# EAGLE design dashbutton_2450_v4 (EAGLE 9.1.3)
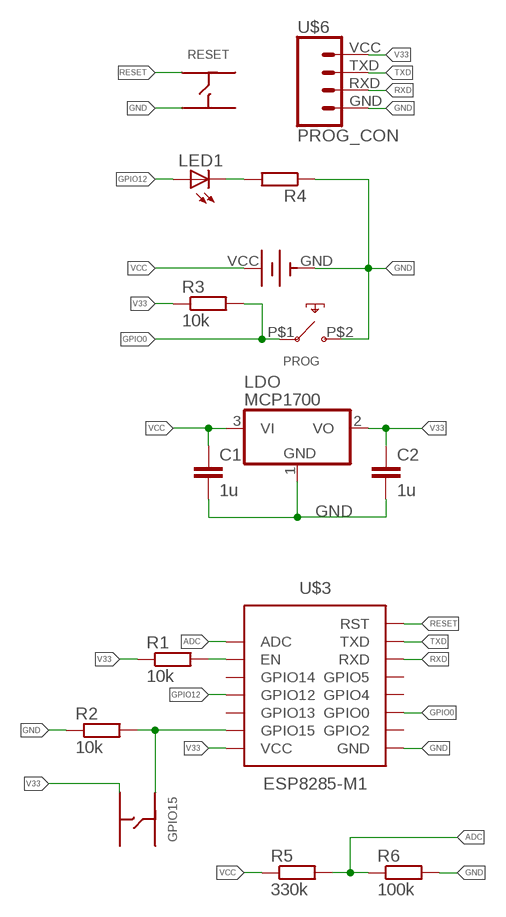
[diagram p0: schematic, sheet 1]

## Parts
C1  1u  C-EUC1206  [C1206]
C2  1u  C-EUC1206  [C1206]
GPIO15  6X6BUTTON  [6X6BUTTON]
LDO  MCP1700  MCP1703CB  [SOT23]
LED1  LEDCHIPLED_1206  [CHIPLED_1206]
PROG  3X4_SMD_BUTTON  [3X4BUTTON]
R1  10k  R-EU_R0603  [R0603]
R2  10k  R-EU_R0603  [R0603]
R3  10k  R-EU_R0603  [R0603]
R4  R-EU_R1206  [R1206]
R5  330k  R-EU_R0603  [R0603]
R6  100k  R-EU_R0603  [R0603]
RESET  6X6BUTTON  [6X6BUTTON]
U$2  2450_BATTERYHOLDER_SMD  [2450_BATTERYHOLDER_SMD]
U$3  ESP8285-M1  [ESP8285-M1]
U$6  PROG_CON  [PROG_CON]

## Nets
ADC: R5.2 R6.1 U$3.ADC
GND: C1.2 C2.2 LDO.1(GND) PROG.P$2(P2) R2.1 R4.1 R6.2 RESET.P1(A1) U$2.GND U$3.GND U$6.GND
GPIO0: PROG.P$1(P1) R3.2 U$3.GPIO0
GPIO12: LED1.A U$3.GPIO12
GPIO15: GPIO15.P4(U2) R2.2 U$3.GPIO15
N$3: LED1.C R4.2
N$5: R1.2 U$3.EN
RESET: RESET.P3(U1) U$3.RST
RXD: U$3.RXD U$6.RXD
TXD: U$3.TXD U$6.TXD
V33: C2.1 GPIO15.P2(A2) LDO.2(VO) R1.1 R3.1 U$3.V33(VCC) U$6.VCC
VCC: C1.1 LDO.3(VI) R5.1 U$2.VCC
Unconnected: GPIO15.P1(A1) GPIO15.P3(U1) RESET.P2(A2) RESET.P4(U2) U$3.GPIO2 U$3.GPIO4 U$3.GPIO5 U$3.GPIO13 U$3.GPIO14

## Library data of the parts
C1 C2 = rcl:C-EU: CAPACITOR, European symbol; SPICEPREFIX: C
GPIO15 RESET = moekoe:6X6BUTTON
LDO = linear:MCP1703: 250 mA, 16V, Low Quiescent Current LDO Regulator Source: http://ww1.microchip.com/downloads/en/DeviceDoc/22049b.pdf
LED1 = adafruit:LED: LED OSRAM: - CHIPLED LG R971, LG N971, LY N971, LG Q971, LY Q971, LO R971, LY R971 LH N974, LH R974 LS Q976, LO Q976, LY Q976 LO Q996 - Hyper CHIPLED LW Q18S LB Q993, LB Q99A, LB R99A - SideLED LS A670, LO A670, LY A670, LG A670, LP A670 LB A673, LV A673, LT A673, LW A673 LH A674 LY A675 LS A676, LA A676, LO A676, LY A676, LW A676 LS A679, LY A679, LG A679 - Hyper Micro SIDELED® LS Y876, LA Y876, LO Y876, LY Y876 LT Y87S - SmartLED LW L88C, LW L88S LB L89C, LB L89S, LG L890 LS L89K, LO L89K, LY L89K LS L896, LA L896, LO L896, LY L896 - TOPLED LS T670, LO T670, LY T670, LG T670, LP T670 LSG T670, LSP T670, LSY T670, LOP T670, LYG T670 LG T671, LOG T671, LSG T671 LB T673, LV T673, LT T673, LW T673 LH T674 LS T676, LA T676, LO T676, LY T676, LB T676, LH T676, LSB T676, LW T676 LB T67C, LV T67C, LT T67C, LS T67K, LO T67K, LY T67K, LW E67C LS E67B, LA E67B, LO E67B, LY E67B, LB E67C, LV E67C, LT E67C LW T67C LS T679, LY T679, LG T679 LS T770, LO T770, LY T770, LG T770, LP T770 LB T773, LV T773, LT T773, LW T773 LH T774 LS E675, LA E675, LY E675, LS T675 LS T776, LA T776, LO T776, LY T776, LB T776 LHGB T686 LT T68C, LB T68C - Hyper Mini TOPLED® LB M676 - Mini TOPLED Santana® LG M470 LS M47K, LO M47K, LY M47K Source: http://www.osram.convergy.de/
PROG = moekoe:3X4_SMD_BUTTON
R1-R6 = rcl:R-EU_: RESISTOR, European symbol; SPICEPREFIX: R
U$2 = moekoe:2450_BATTERYHOLDER_SMD
U$3 = moekoe:ESP8285-M1
U$6 = moekoe:PROG_CON

## Board
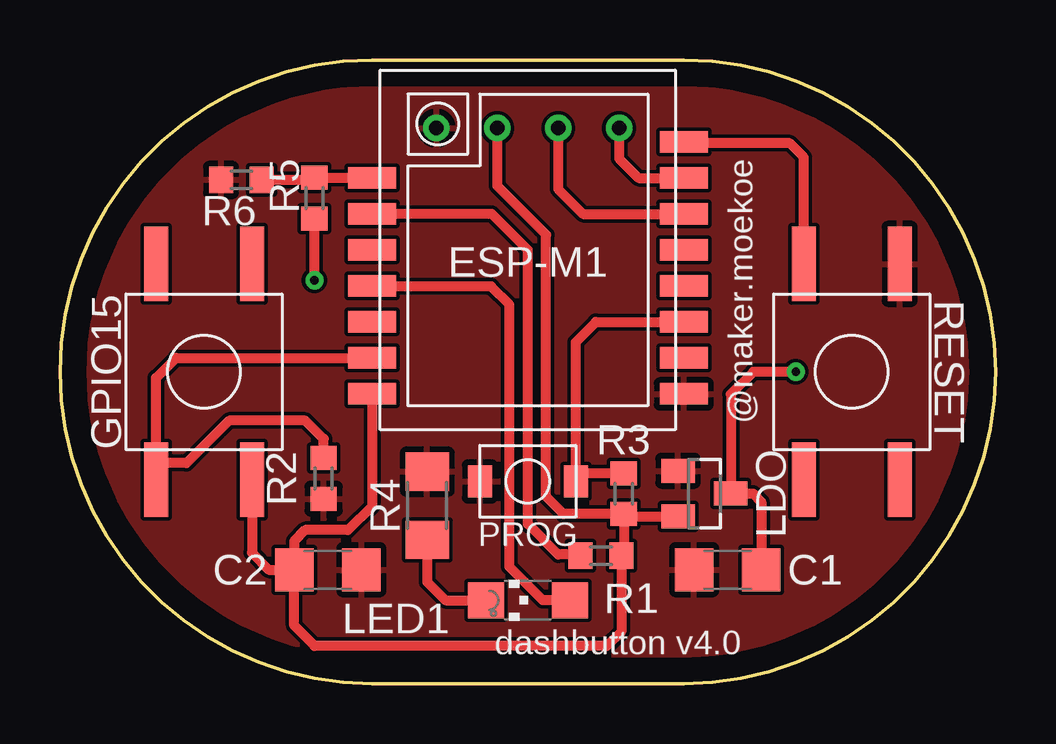
[diagram p1: board, top side]
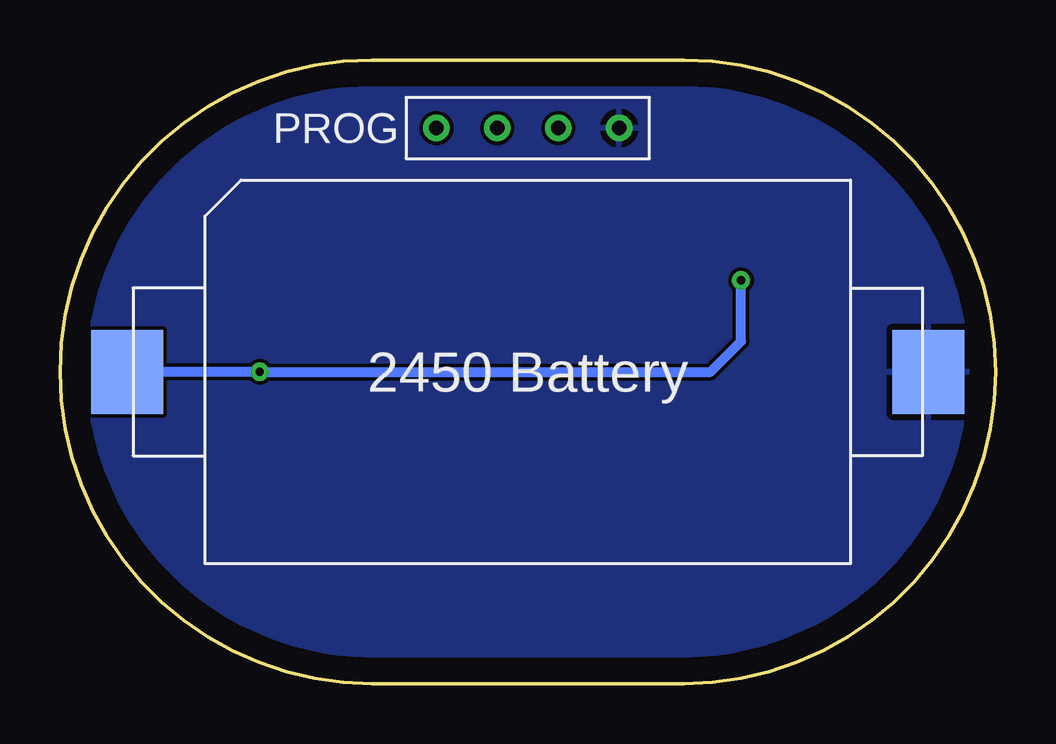
[diagram p2: board, bottom side, seen from below]

Size 39 x 26 mm. Coordinates in mm from the lower left corner, seen from the top.
Outline: 39,13 arc-90 26,0 13,0 arc-90 0,13 arc-90 13,26 26,26 arc-90 39,13
Copper layers (1*16): Top 0.035mm / dielectric 1.5mm / Bottom 0.035mm
Design rules "default": minimum track width 6mil, minimum drill 0.35mm, track to track 6mil, track to pad 6mil, pad to pad 6mil, via to via 6mil, smd to smd 6mil, copper to edge 40mil, drill to drill 6mil, minimum pad ring 10mil, minimum via ring 8mil, stop-mask expansion 4mil, vias tented up to drill 0mil, thermal gap 10mil

### Footprints (pad centres in the part's own frame; a part is rotated, then mirrored left to right if it is on the bottom)
C1206 = smd 1.6 x 1.8: 1 -1.4,0; 2 1.4,0
6X6BUTTON = smd 3.1 x 1: P1 -4.5,2; P2 4.5,2; P3 -4.5,-2; P4 4.5,-2
SOT23 = smd 1 x 1.4: 1 -0.95,-1.1; 2 0.95,-1.1; 3 0,1.1
CHIPLED_1206 = smd 1.5 x 1.5: A 0,-1.75; C 0,1.75
3X4BUTTON = smd 1 x 1.35: P$1 -2,0; P$2 2,0
R0603 = smd 1 x 1.1: 1 -0.85,0; 2 0.85,0
R1206 = smd 1.6 x 1.803: 1 -1.422,0; 2 1.422,0
2450_BATTERYHOLDER_SMD = smd 3 x 3.5: GND 16.7,0; VCC -16.7,0
ESP8285-M1 = smd 2 x 0.9: ADC -6.5,3; EN -6.5,1.5; GND 6.5,-6; GPIO0 6.5,-3; GPIO2 6.5,-4.5; GPIO4 6.5,-1.5; GPIO5 6.5,0; GPIO12 -6.5,-1.5; GPIO13 -6.5,-3; GPIO14 -6.5,0; GPIO15 -6.5,-4.5; RST 6.5,4.5; RXD 6.5,1.5; TXD 6.5,3; V33 -6.5,-6
PROG_CON = drill 0.6: GND 3.81,0; RXD -1.27,0; TXD -3.81,0; VCC 1.27,0

### Placement (x,y rotation side)
C1  27.84,4.74 180 top
C2  11.16,4.74 0 top
GPIO15  6,13 270 top
LDO  26.87,7.92 270 top
LED1  19.5,3.47 90 top
PROG  19.5,8.43 180 top
R1  22.55,5.33 180 top
R2  10.99,8.55 90 top
R3  23.5,7.92 90 top
R4  15.31,7.41 270 top
R5  10.61,20.24 90 top
R6  7.56,21 180 top
RESET  33,13 270 top
U$2  19.5,13 0 bottom
U$3  19.5,18.08 0 top
U$6  19.5,23.16 0 bottom

### Tracks (layer width: path | path; a pad name or v marks a point on that pad's centre or on a via)
ADC
  Top 0.406: R6.1 10.52,21 R5.2 U$3.ADC
GND
  pour Top: -0.82,26.97 39.82,26.97 39.82,-0.97 -0.82,-0.97
  pour Bottom: -0.82,26.97 39.82,26.97 39.82,-0.97 -0.82,-0.97
GPIO0
  Top 0.406: PROG.P$1 21.5,14.24 22.34,15.08 U$3.GPIO0 | 21.84,8.77 PROG.P$1 | R3.2 21.84,8.77 | 21.84,8.77 PROG.P$1
GPIO12
  Top 0.406: U$3.GPIO12 13.02,16.56 17.98,16.56 18.74,15.79 18.74,4.87 20.14,3.47 LED1.A
GPIO15
  Top 0.406: 4,9.19 4,12.74 4.84,13.58 U$3.GPIO15 | R2.2 10.99,10.21 10.23,10.97 7.05,10.97 5.28,9.19 4,9.19 | GPIO15.P4 4,9.19
N$3
  Top 0.406: R4.2 15.31,4.24 16.07,3.47 LED1.C
N$5
  Top 0.406: U$3.EN 18,19.58 19.5,18.08 19.5,6.65 20.77,5.38 21.65,5.38 R1.2
RESET
  Top 0.406: RESET.P3 31,21.95 30.42,22.52 26.05,22.52 U$3.RST
RXD
  Top 0.406: U$3.RXD 21.81,19.58 20.77,20.62 U$6.RXD
TXD
  Top 0.406: U$3.TXD 24.12,21.08 23.31,21.89 U$6.TXD
V33
  Top 0.406: U$3.V33 13.15,11.93 | U$3.V33 13.15,11.93 | U$3.V33 13.15,11.93 | R3.1 23.6,6.97 LDO.2 | GPIO15.P2 8,5.45 8.71,4.74 C2.1 | C2.1 9.76,2.42 10.61,1.57 22.8,1.57 23.4,2.17 R1.1 23.5,5.43 R3.1 | R3.1 20.98,7.07 20.26,7.79 20.26,18.71 18.23,20.75 U$6.VCC | U$3.V33 13,7.39 12.01,6.4 10.23,6.4 9.76,5.93 C2.1
VCC  (via drill 0.35)
  Top 0.406: C1.1 29.24,7.58 28.9,7.92 LDO.3 27.97,12.07 28.9,13 v30.68,13 | v10.61,16.81 R5.1
  Bottom 0.406: U$2.VCC v30.68,13 11.88,13 10.61,14.27 v10.61,16.81

### Text on the board
tNames: @maker.moekoe | dashbutton v4.0